# EAGLE design Esquematico ODJ-Raptor (EAGLE 7.6.0)
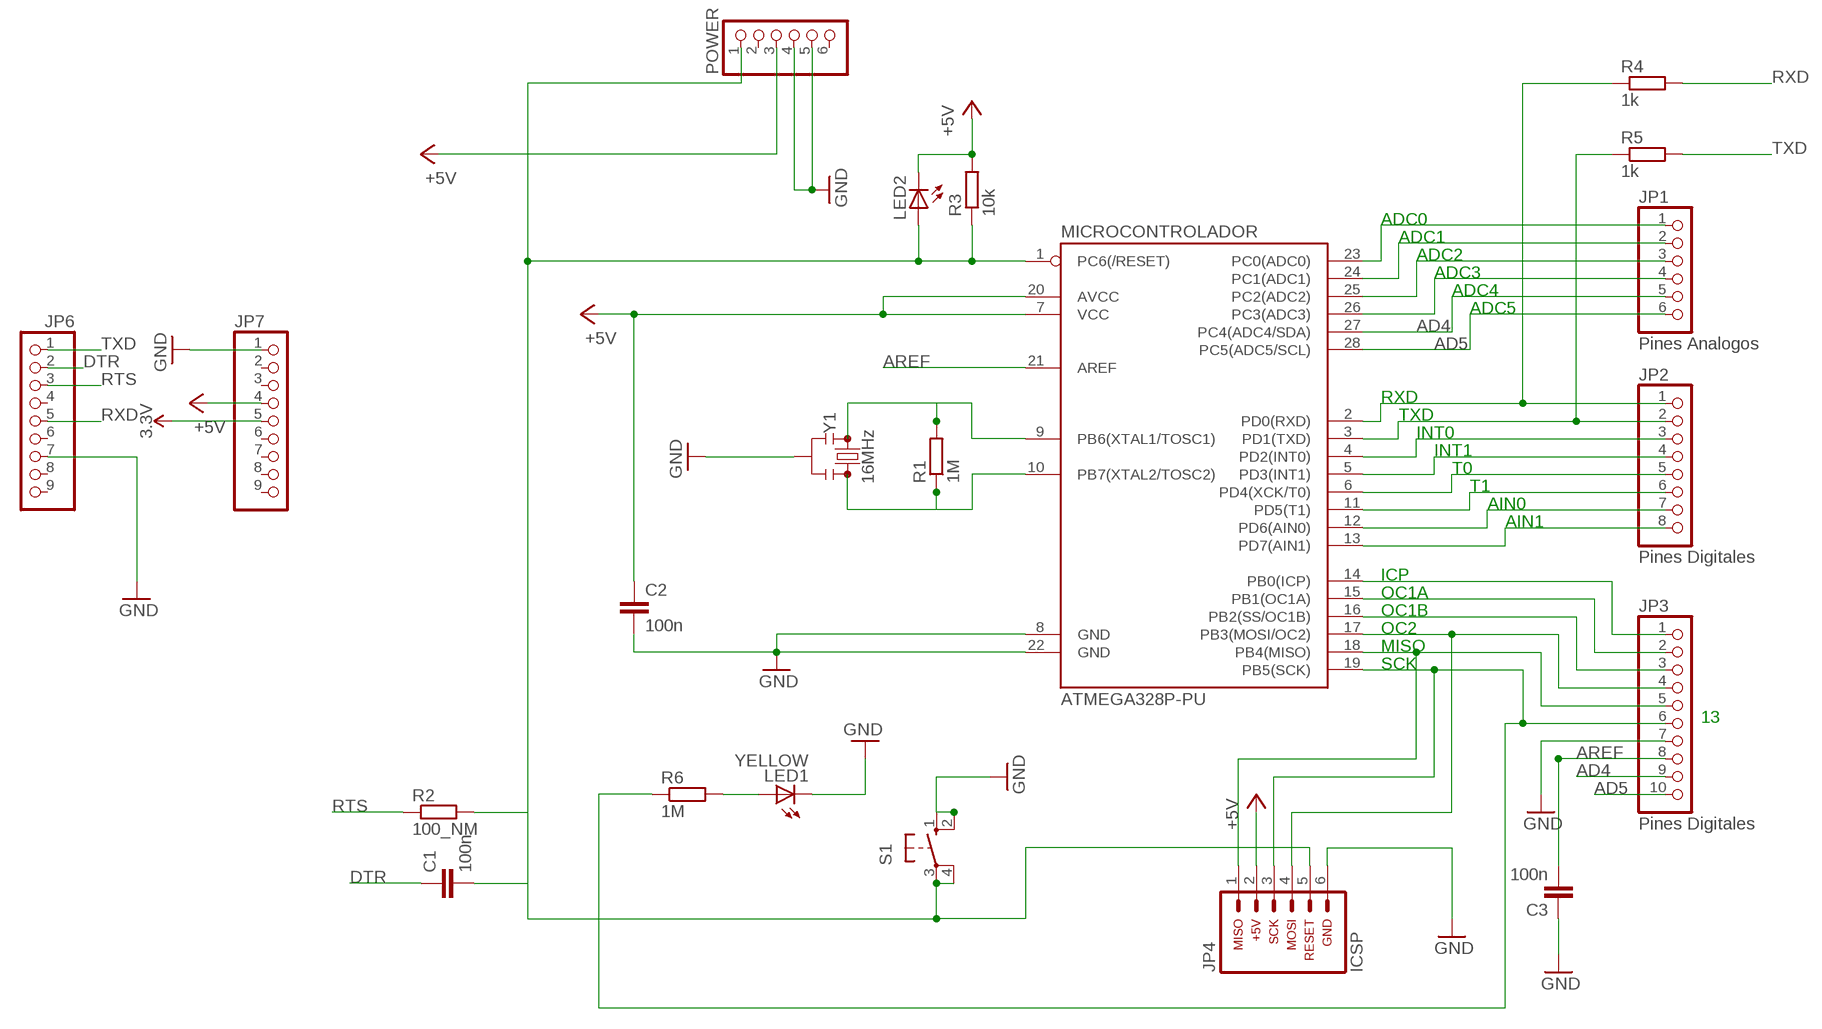
[diagram p0: schematic, sheet 1]

## Parts
C1  100n  C2.5/2  [C2.5-2]
C2  100n  C2.5/2  [C2.5-2]
C3  100n  C2.5/2  [C2.5-2]
JP1  Pines Analogos  PINHD-1X6  [1X06]
JP2  Pines Digitales  PINHD-1X8  [1X08]
JP3  Pines Digitales  PINHD-1X10  [1X10]
JP4  ARDUINO_CONN-ICSP  [CONN-2X03]
JP6  PINHD-1X9  [1X09-BIG]
JP7  PINHD-1X9  [1X09-BIG]
LED1  YELLOW  LED  [SMARTLED-TTW]
LED2  LED  [SMARTLED-TTW]
MICROCONTROLADOR  ATMEGA328P-PU  ATMEGA328P_PDIP  [DIP28]
POWER  PINHD-1X6  [1X06]
R1  1M  R-EU_0204/7  [0204/7]
R2  100_NM  R-EU_0204/7  [0204/7]
R3  10k  R-EU_0204/7  [0204/7]
R4  1k  R-EU_0204/7  [0204/7]
R5  1k  R-EU_0204/7  [0204/7]
R6  1M  R-EU_0204/7  [0204/7]
S1  10-XX  [B3F-10XX]
Y1  16MHz  RESONATOR-16MHZSMD_3.2X1.3  [RESONATOR-SMD-3.2X1.3]

## Nets
3.3V: JP7.5
+5V: C2.1 JP4.2 JP7.4 LED2.C@1(C) MICROCONTROLADOR.7(VCC) MICROCONTROLADOR.20(AVCC) POWER.3 R3.2
AD4: JP1.5 JP3.9 MICROCONTROLADOR.27(PC4(ADC4/SDA))
AD5: JP1.6 JP3.10 MICROCONTROLADOR.28(PC5(ADC5/SCL))
AREF: C3.2 JP3.8 MICROCONTROLADOR.21(AREF)
DTR: C1.1 JP6.2
GND: C2.2 C3.1 JP3.7 JP4.6 JP6.7 JP7.1 LED1.C@1(C) MICROCONTROLADOR.8(GND) MICROCONTROLADOR.22(GND) POWER.4 POWER.5 S1.1(S) S1.2(S1) Y1.2
N$1: JP1.1 MICROCONTROLADOR.23(PC0(ADC0))
N$2: JP1.2 MICROCONTROLADOR.24(PC1(ADC1))
N$3: JP1.3 MICROCONTROLADOR.25(PC2(ADC2))
N$4: JP1.4 MICROCONTROLADOR.26(PC3(ADC3))
N$7: JP2.1 MICROCONTROLADOR.2(PD0(RXD)) R4.1
N$8: JP2.2 MICROCONTROLADOR.3(PD1(TXD)) R5.1
N$9: JP2.3 MICROCONTROLADOR.4(PD2(INT0))
N$10: JP2.4 MICROCONTROLADOR.5(PD3(INT1))
N$11: JP2.5 MICROCONTROLADOR.6(PD4(XCK/T0))
N$12: JP2.6 MICROCONTROLADOR.11(PD5(T1))
N$13: JP2.7 MICROCONTROLADOR.12(PD6(AIN0))
N$14: JP2.8 MICROCONTROLADOR.13(PD7(AIN1))
N$15: JP3.1 MICROCONTROLADOR.14(PB0(ICP))
N$16: JP3.2 MICROCONTROLADOR.15(PB1(OC1A))
N$17: JP3.3 MICROCONTROLADOR.16(PB2(SS/OC1B))
N$18: JP3.4 JP4.4 MICROCONTROLADOR.17(PB3(MOSI/OC2))
N$19: JP3.5 JP4.1 MICROCONTROLADOR.18(PB4(MISO))
N$20: JP3.6 JP4.3 MICROCONTROLADOR.19(PB5(SCK)) R6.1
N$21: MICROCONTROLADOR.9(PB6(XTAL1/TOSC1)) R1.2 Y1.1
N$22: MICROCONTROLADOR.10(PB7(XTAL2/TOSC2)) R1.1 Y1.3
N$23: C1.2 JP4.5 LED2.A@1(A) MICROCONTROLADOR.1(PC6(/RESET)) POWER.1 R2.2 R3.1 S1.3(P) S1.4(P1)
N$30: LED1.A@1(A) R6.2
RTS: JP6.3 R2.1
RXD: JP6.5 R4.2
TXD: JP6.1 R5.2
Unconnected: JP6.4 JP6.6 JP6.8 JP6.9 JP7.2 JP7.3 JP7.6 JP7.7 JP7.8 JP7.9 POWER.2 POWER.6

## Notes on the sheet
- ADC0
- ADC1
- ADC2
- ADC3
- ADC4
- ADC5
- RXD
- TXD
- INT0
- INT1
- T0
- T1
- AIN0
- AIN1
- ICP
- OC1A
- OC1B
- OC2
- MISO
- SCK
- 13

## Library data of the parts
C1-C3 = capacitor-wima:C: CAPACITOR naming: grid - package width
JP1 = pinhead:PINHD-1X6: PIN HEADER
JP2 = pinhead:PINHD-1X8: PIN HEADER
JP3 = pinhead:PINHD-1X10: PIN HEADER
JP4 = arduino_jw:ARDUINO_CONN-ICSP: Arduino ICSP I/O Header This is the ICSP I/O header on the Arduino Uno R3. This connector is labeled with the following pin assignments: MISO +5V SCK MOSI RESET GND NOTE: Be sure you install this connector with the correct orientation on your PCB layout. Pin 1 has a square pad to assist with orientation.
JP6 JP7 = adafruit:PINHD-1X9: Pin header 1x10 0.1" spacing With round pins
LED1 = adafruit:LED: LED
LED2 = led:LED: LED
MICROCONTROLADOR = SparkFun-IC-Microcontroller:ATMEGA328P_PDIP: Atmel 328P Through hole ATMEGA328P uC used in the Arduino 32kb flash, 1k EEPROM, 2k SRAM Datasheet <http://www.sparkfun.com/datasheets/Components/SMD/ATMega328.pdf> SparkFun Products Storefront component: AVR 28 Pin 20MHz 32K 6A/D - ATMega328P <https://www.sparkfun.com/products/9061> (COM-09061) SparkFun Simon Says - Through-Hole Soldering Kit <https://www.sparkfun.com/products/10547> (KIT-10547) SparkFun Learn to Solder - Simon Says <https://www.sparkfun.com/products/13708> (KIT-13708) SparkFun BigTime Watch Kit <https://www.sparkfun.com/products/11734> (KIT-11734) SparkFun ClockIt <https://www.sparkfun.com/products/10930> (KIT-10930) SparkFun Serial Enabled LCD Kit <https://www.sparkfun.com/products/10097> (LCD-10097) SparkFun Simon Tilts - Through Hole Soldering Kit <https://www.sparkfun.com/products/12634> (KIT-12634) SparkFun Frequency Counter Kit <https://www.sparkfun.com/products/10140> (KIT-10140) FabFM Radio Kit <https://www.sparkfun.com/products/11043> (KIT-11043) SparkFun Binary Blaster Kit <https://www.sparkfun.com/products/12037> (KIT-12037) SparkFun Metro-Gnome <https://www.sparkfun.com/products/9236> (KIT-09236) ATmega328 with Arduino Optiboot (Uno) <https://www.sparkfun.com/products/10524> (DEV-10524); PROD_ID: IC-09136; VALUE: 328P
POWER = adafruit:PINHD-1X6: PIN HEADER
R1-R6 = resistor:R-EU_: RESISTOR, European symbol
S1 = switch-omron:10-XX: OMRON SWITCH; MPN: B3F-1000; OC_FARNELL: 176432; OC_NEWARK: 36M3542
Y1 = SparkFun-Clocks:RESONATOR-16MHZ: 16MHz Resonator Digikey Example <http://www.digikey.com/product-detail/en/murata-electronics-north-america/CSTCE16M0V53-R0/490-1198-1-ND/584635> Frequency: 16MHz Frequency Stability: ±0.3% Frequency Tolerance: ±0.5% Capacitance: 15pF SparkFun Products SparkFun OpenLog <https://www.sparkfun.com/products/13712> SparkFun MicroView - OLED Arduino Module <https://www.sparkfun.com/products/12923>; PROD_ID: XTAL-08900

## Board
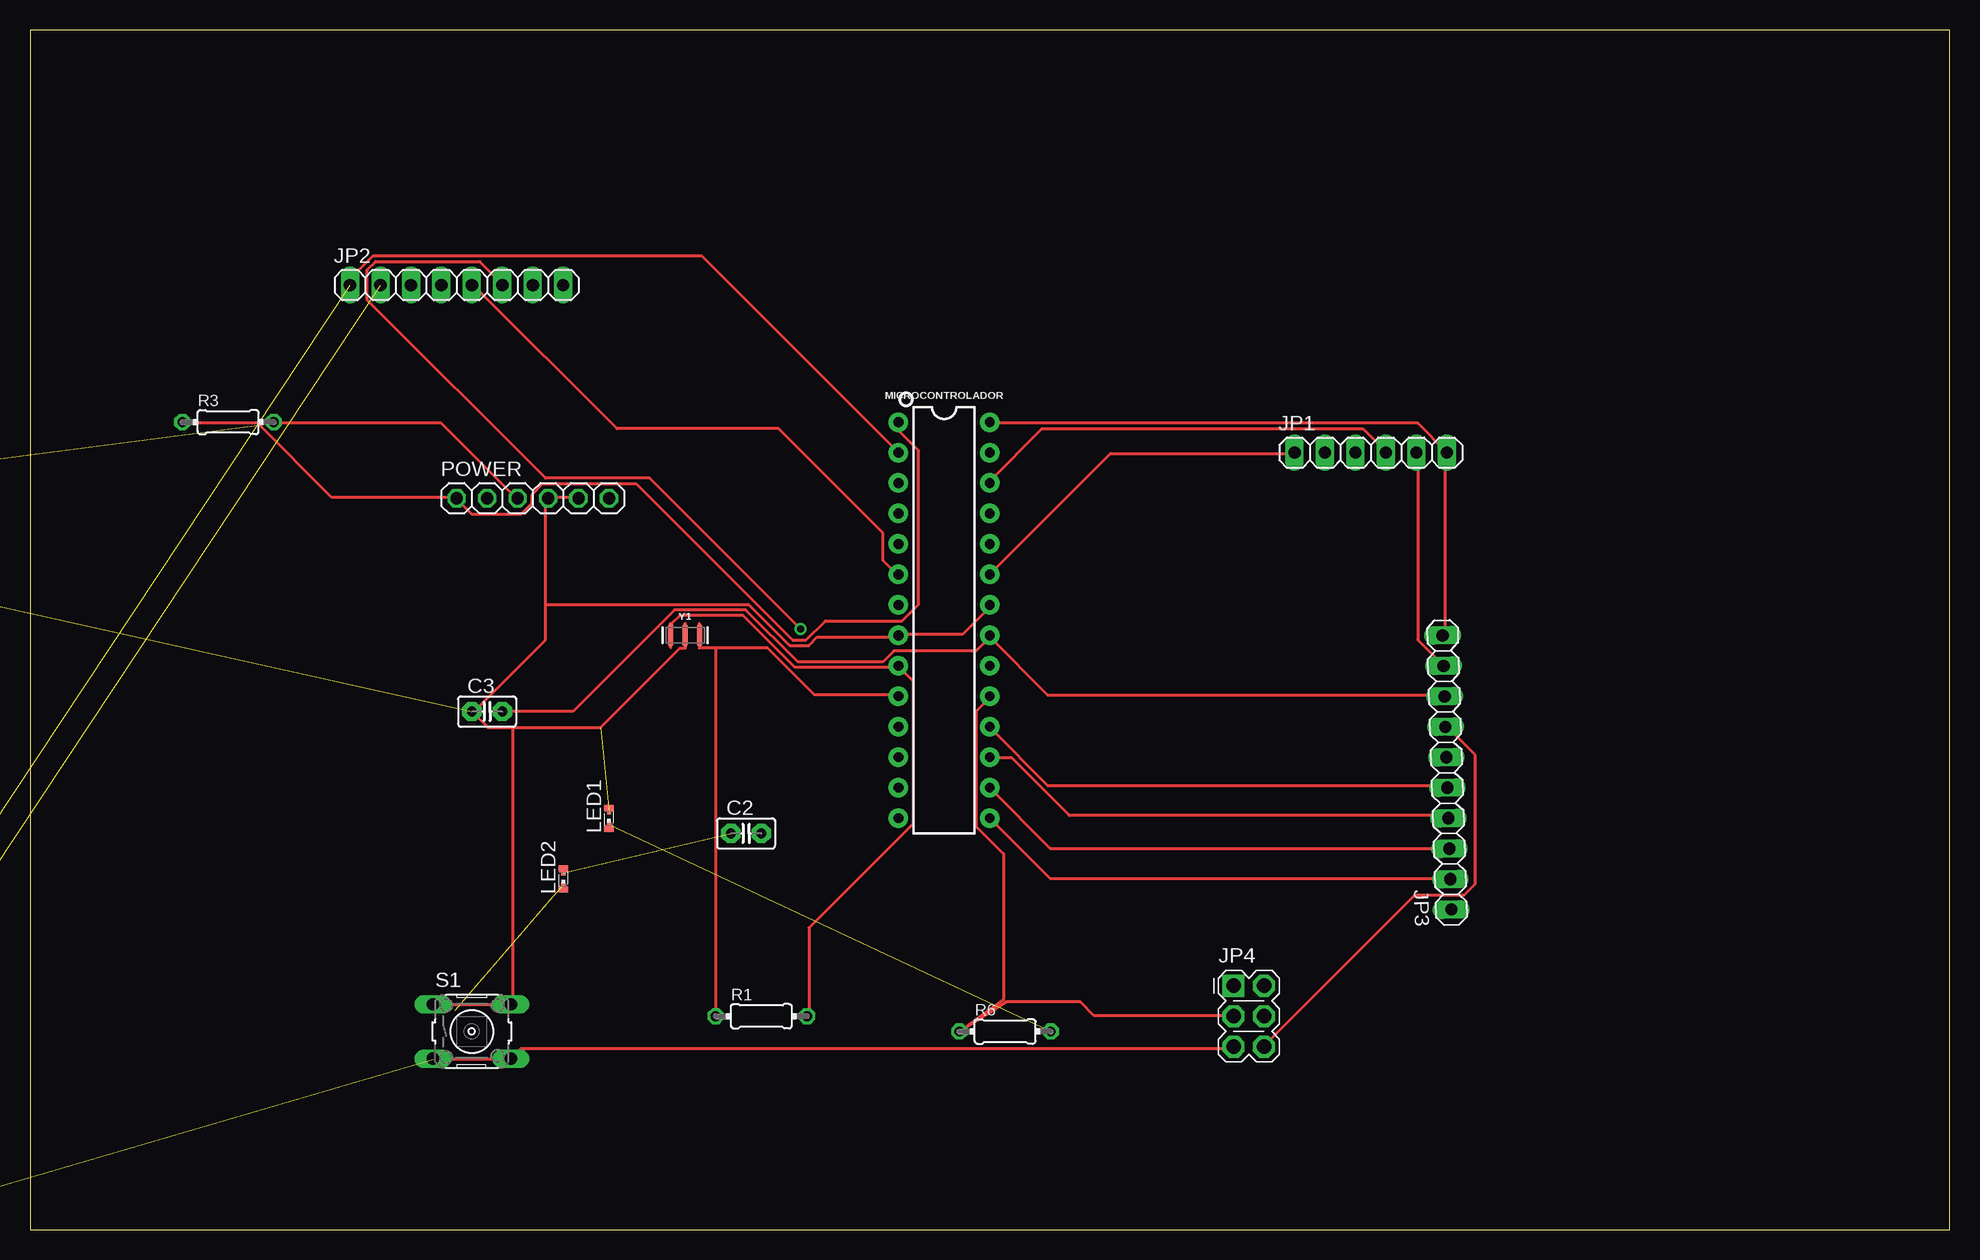
[diagram p1: board, top side]
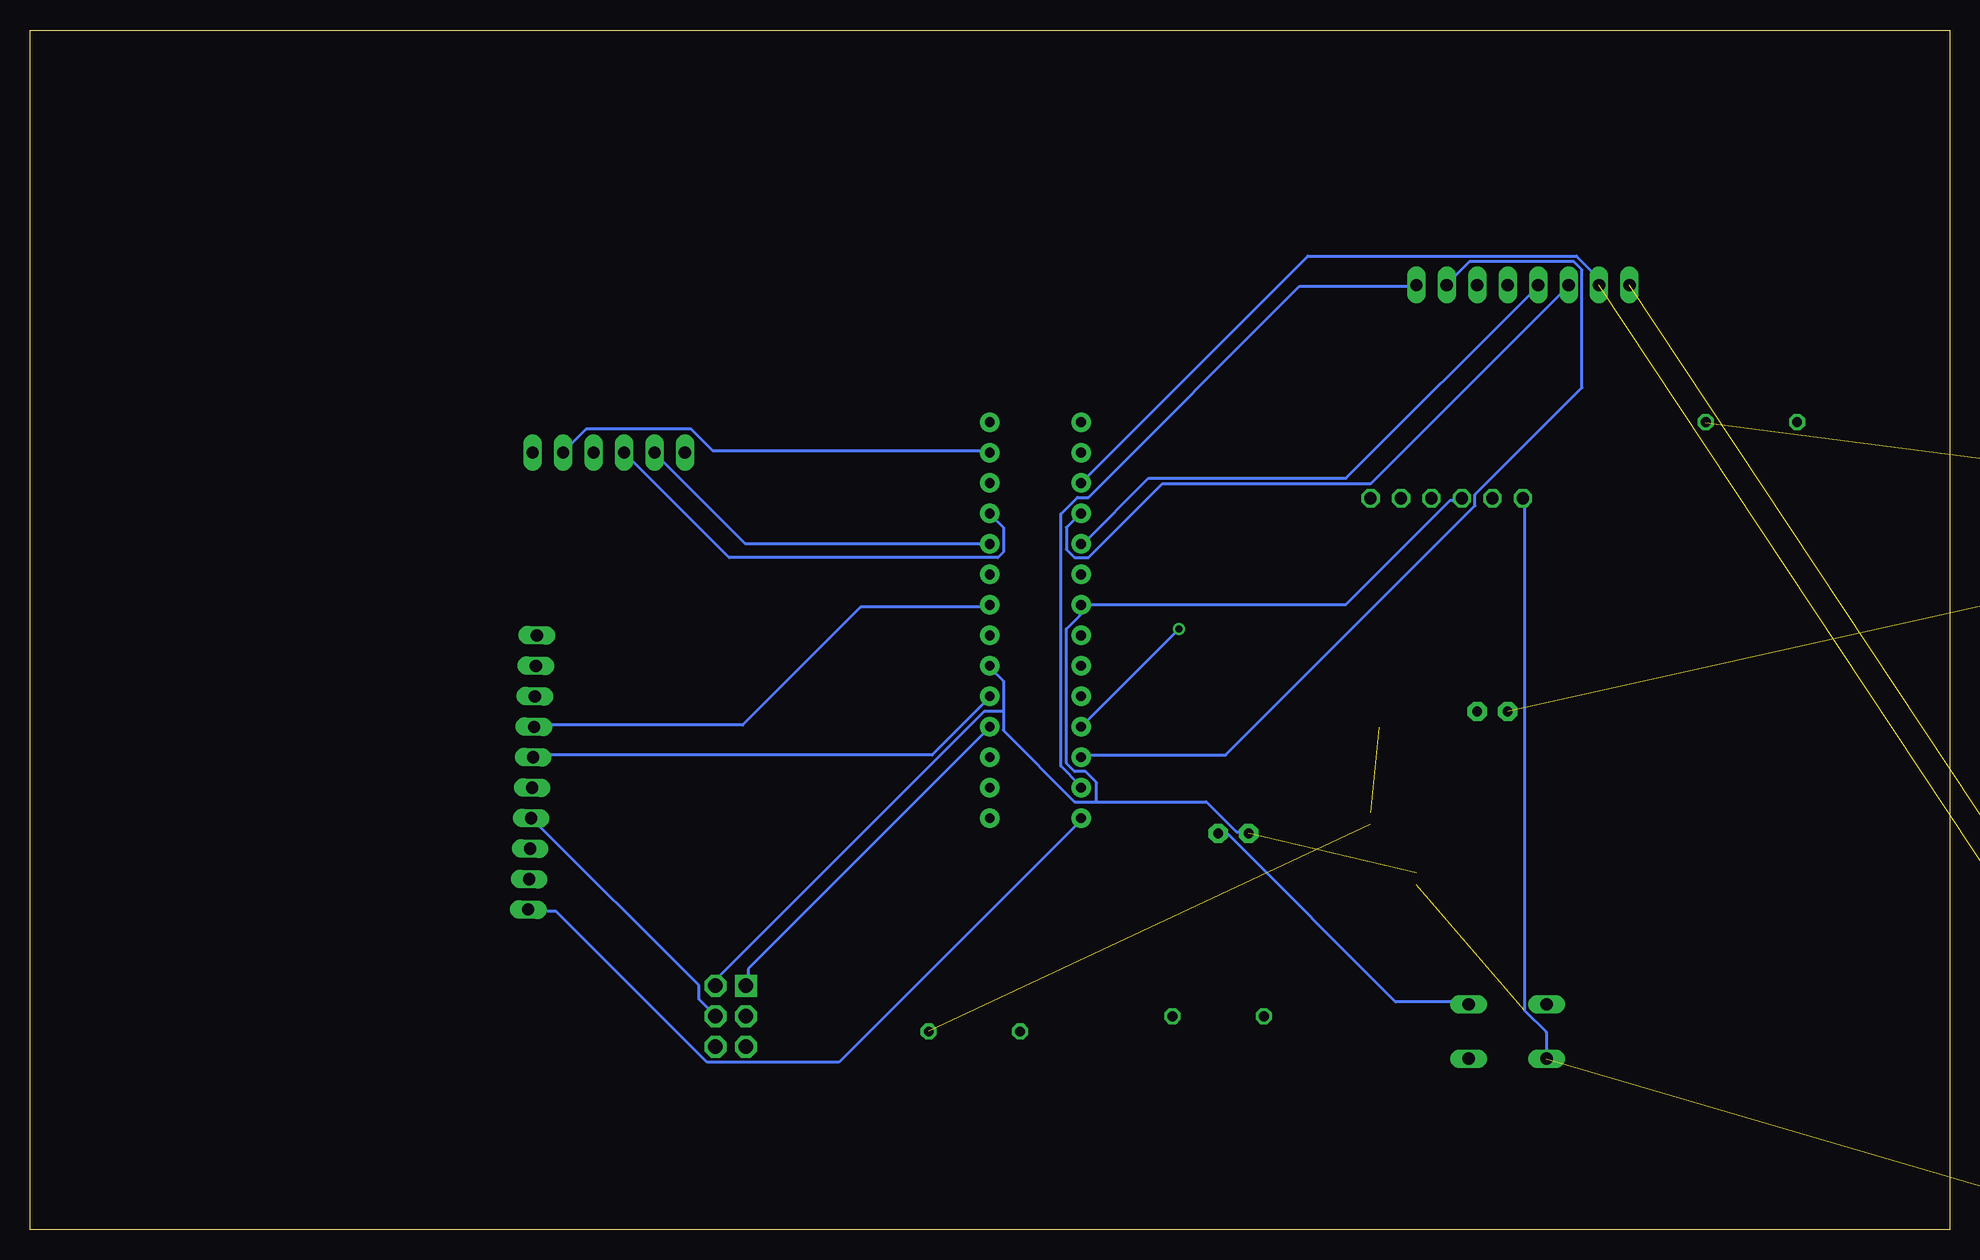
[diagram p2: board, bottom side, seen from below]

Size 160 x 100 mm. Coordinates in mm from the lower left corner, seen from the top.
Outline: 0,0 160,0 160,100 0,100 0,0
Copper layers (1*16): Top 0.035mm / dielectric 1.5mm / Bottom 0.035mm
Design rules "default": minimum track width 10mil, minimum drill 24mil, track to track 8mil, track to pad 8mil, pad to pad 8mil, via to via 8mil, smd to smd 8mil, copper to edge 40mil, drill to drill 8mil, minimum pad ring 10mil, minimum via ring 8mil, stop-mask expansion 4mil, vias tented up to drill 0mil, thermal gap 10mil

### Footprints (pad centres in the part's own frame; a part is rotated, then mirrored left to right if it is on the bottom)
C2.5-2 = drill 0.813 pad 1.6 octagon: 1 -1.27,0; 2 1.27,0
1X06 = drill 1.016 long: 1 -6.35,0; 2 -3.81,0; 3 -1.27,0; 4 1.27,0; 5 3.81,0; 6 6.35,0
1X08 = drill 1.016 long: 1 -8.89,0; 2 -6.35,0; 3 -3.81,0; 4 -1.27,0; 5 1.27,0; 6 3.81,0; 7 6.35,0; 8 8.89,0
1X10 = drill 1.016 long: 1 -11.43,0; 2 -8.89,0; 3 -6.35,0; 4 -3.81,0; 5 -1.27,0; 6 1.27,0; 7 3.81,0; 8 6.35,0; 9 8.89,0; 10 11.43,0
CONN-2X03 = drill 1.2 pad 1.829 square: 1 0,0 | drill 1.2 pad 1.829 octagon: 2 2.54,0; 3 0,-2.54; 4 2.54,-2.54; 5 0,-5.08; 6 2.54,-5.08
1X09-BIG = drill 1.016 pad 1.778 octagon: 1 -10.16,0; 2 -7.62,0; 3 -5.08,0; 4 -2.54,0; 5 0,0; 6 2.54,0; 7 5.08,0; 8 7.62,0; 9 10.16,0
SMARTLED-TTW = smd 0.8 x 0.5: A 0,-0.875; C 0,0.875 | smd 0.35 x 0.35: A@1 0,-0.5; C@1 0,0.5
DIP28 = drill 0.813 pad 1.626: 1 -16.51,-3.81; 2 -13.97,-3.81; 3 -11.43,-3.81; 4 -8.89,-3.81; 5 -6.35,-3.81; 6 -3.81,-3.81; 7 -1.27,-3.81; 8 1.27,-3.81; 9 3.81,-3.81; 10 6.35,-3.81; 11 8.89,-3.81; 12 11.43,-3.81; 13 13.97,-3.81; 14 16.51,-3.81; 15 16.51,3.81; 16 13.97,3.81; 17 11.43,3.81; 18 8.89,3.81; 19 6.35,3.81; 20 3.81,3.81; 21 1.27,3.81; 22 -1.27,3.81; 23 -3.81,3.81; 24 -6.35,3.81; 25 -8.89,3.81; 26 -11.43,3.81; 27 -13.97,3.81; 28 -16.51,3.81
1X06' = drill 1.016 octagon: 1 -6.35,0; 2 -3.81,0; 3 -1.27,0; 4 1.27,0; 5 3.81,0; 6 6.35,0
0204/7 = drill 0.813 octagon: 1 -3.81,0; 2 3.81,0
B3F-10XX = drill 1.016 long: 1 -3.251,2.261; 2 3.251,2.261; 3 -3.251,-2.261; 4 3.251,-2.261
RESONATOR-SMD-3.2X1.3 = smd 0.45 x 1.905: 1 -1.2,0; 2 0,0; 3 1.2,0

### Placement (x,y rotation side)
C1  -34.29,-8.89 0 top  (outside the outline)
C2  59.69,33.02 0 top
C3  38.1,43.18 0 top
JP1  111.76,64.77 0 top
JP2  35.56,78.74 0 top
JP3  118.11,38.1 91.8 top
JP4  100.33,20.32 0 top
JP6  -25.4,55.88 0 top  (outside the outline)
JP7  -25.4,60.96 0 top  (outside the outline)
LED1  48.26,34.29 0 top
LED2  44.45,29.21 0 top
MICROCONTROLADOR  76.2,50.8 270 top
POWER  [1X06']  41.91,60.96 0 top
R1  60.96,17.78 0 top
R2  -31.75,-3.81 0 top  (outside the outline)
R3  16.51,67.31 0 top
R4  -31.75,-15.24 0 top  (outside the outline)
R5  -31.75,-19.05 0 top  (outside the outline)
R6  81.28,16.51 0 top
S1  36.83,16.51 0 top
Y1  54.61,49.53 0 top

### Tracks (layer width: path | path; a pad name or v marks a point on that pad's centre or on a via)
+5V  (2 unrouted)
  Top 0.254: R3.2 20.34,67.21 34.29,67.21 40.46,61.04 POWER.3
  Bottom 0.254: 71.09,35.66 72.92,35.66 78.87,41.6 78.87,43.2 | 71.09,35.66 61.95,35.66 59.44,33.15 58.52,33.15 C2.1 | 78.87,43.2 78.87,45.72 80.01,46.86 MICROCONTROLADOR.20 | 71.09,35.66 71.09,37.26 72.01,38.18 72.92,38.18 73.61,38.86 73.61,50.06 72.47,51.21 72.47,51.89 MICROCONTROLADOR.7 72.24,52.12 50.29,52.12 41.6,60.81 40.69,60.81 POWER.3 | JP4.2 102.87,20.8 80.47,43.2 78.87,43.2
AD4
  Top 0.254: JP3.9 117.73,47.09 115.67,49.15 115.67,64.69 JP1.5
  Bottom 0.254: MICROCONTROLADOR.27 80.01,64.92 103.1,64.92 104.93,66.75 113.61,66.75 115.44,64.92 JP1.5
AD5
  Top 0.254: JP3.10 117.96,49.61 117.96,64.69 JP1.6 115.67,67.21 80.01,67.21 MICROCONTROLADOR.28
AREF
  Top 0.254: 80.01,49.38 84.81,44.58 117.73,44.58 JP3.8 | 80.01,49.38 78.87,48.23 72.01,48.23 71.09,47.32 64.01,47.32 59.66,51.66 53.72,51.66 45.26,43.2 39.55,43.2 C3.2 | 80.01,49.38 MICROCONTROLADOR.21
DTR  (1 unrouted)
GND  (3 unrouted)
  Top 0.254: JP3.7 118.19,41.83 120.47,39.55 120.47,28.8 119.56,27.89 115.44,27.89 102.87,15.32 JP4.6 | S1.1 33.6,18.75 40.01,18.75 S1.2 40.23,18.97 40.23,41.83 | MICROCONTROLADOR.22 80.01,51.89 77.72,49.61 72.47,49.61 MICROCONTROLADOR.8 72.24,49.38 65.61,49.38 64.92,48.69 63.32,48.69 59.89,52.12 42.98,52.12 | POWER.5 45.72,61.04 43.2,61.04 POWER.4 42.98,60.81 42.98,52.12 | 40.23,41.83 38.18,41.83 C3.1 37.03,43.2 42.98,49.15 42.98,52.12 | 40.23,41.83 47.55,41.83 54.18,48.46 54.63,48.46 54.61,48.51
  Bottom 0.254: C2.2 60.81,32.92 60.12,32.92 46.18,18.97 40.23,18.97 S1.2 | JP3.7 117.96,42.06 100.58,42.06 90.75,51.89 80.01,51.89 MICROCONTROLADOR.22
N$1
  Top 0.254: JP1.1 105.39,64.69 90.07,64.69 80.01,54.63 MICROCONTROLADOR.23
N$2
  Bottom 0.254: MICROCONTROLADOR.24 100.36,57.15 107.9,64.69 JP1.2
N$3
  Bottom 0.254: JP1.3 101.73,56.01 79.32,56.01 78.87,56.46 78.87,58.52 80.01,59.66 MICROCONTROLADOR.25
N$4
  Top 0.254: JP1.4 112.93,64.92 111.1,66.75 84.35,66.75 80.01,62.41 MICROCONTROLADOR.26
N$7  (1 unrouted)
  Top 0.254: MICROCONTROLADOR.2 56.01,81.15 28.57,81.15 26.75,79.32 26.75,78.87 JP2.1
N$8  (1 unrouted)
  Bottom 0.254: JP2.2 29.26,78.87 29.26,79.32 31.09,81.15 53.49,81.15 72.24,62.41 MICROCONTROLADOR.3
N$9
  Bottom 0.254: JP2.3 31.77,78.64 48.23,62.18 65.61,62.18 71.78,56.01 72.92,56.01 73.61,56.69 73.61,58.52 72.47,59.66 MICROCONTROLADOR.4
N$10
  Bottom 0.254: JP2.4 34.29,78.64 50.29,62.64 66.75,62.64 72.24,57.15 MICROCONTROLADOR.5
N$11
  Top 0.254: JP2.5 37.03,78.64 48.92,66.75 62.41,66.75 71.09,58.06 71.09,55.78 72.24,54.63 MICROCONTROLADOR.6
N$12  (via drill 0.61)
  Top 0.254: v64.24,50.06 51.66,62.64 42.98,62.64 28.12,77.5 28.12,80.01 28.8,80.7 37.49,80.7 39.32,78.87 JP2.6
  Bottom 0.254: MICROCONTROLADOR.11 v64.24,50.06
N$13
  Bottom 0.254: JP2.7 41.83,78.87 40.01,80.7 31.32,80.7 30.63,80.01 30.63,70.18 39.55,61.27 39.55,60.35 60.35,39.55 72.24,39.55 MICROCONTROLADOR.12
N$14
  Bottom 0.254: JP2.8 44.58,78.64 54.18,78.64 71.78,61.04 72.69,61.04 74.07,59.66 74.07,38.63 72.47,37.03 MICROCONTROLADOR.13
N$15
  Bottom 0.254: JP3.1 118.42,26.52 116.13,26.52 103.56,13.95 92.58,13.95 72.24,34.29 MICROCONTROLADOR.14
N$16
  Top 0.254: MICROCONTROLADOR.15 85.04,29.26 118.19,29.26 JP3.2
N$17
  Top 0.254: JP3.3 118.19,31.77 85.04,31.77 80.01,36.8 MICROCONTROLADOR.16
N$18
  Top 0.254: MICROCONTROLADOR.17 80.01,39.32 81.84,39.32 86.64,34.52 118.19,34.52 JP3.4
  Bottom 0.254: JP3.4 118.19,34.29 104.24,20.34 104.24,19.2 102.87,17.83 JP4.4
N$19
  Top 0.254: JP3.5 117.96,37.03 84.81,37.03 80.01,41.83 MICROCONTROLADOR.18
  Bottom 0.254: JP4.1 100.13,20.34 100.13,21.72 80.01,41.83 MICROCONTROLADOR.18
N$20
  Top 0.254: JP4.3 100.13,17.83 88.7,17.83 87.55,18.97 81.38,18.97 R6.1 81.15,19.2 81.15,31.32 78.87,33.6 78.87,43.2 80.01,44.35 MICROCONTROLADOR.19
  Bottom 0.254: JP3.6 117.96,39.55 84.81,39.55 80.01,44.35 MICROCONTROLADOR.19
N$21
  Top 0.254: Y1.1 53.49,50.52 54.18,51.21 59.44,51.21 63.78,46.86 72.24,46.86 MICROCONTROLADOR.9 72.47,46.86 73.61,45.72 73.61,33.83 64.92,25.15 64.92,17.83 R1.2
N$22
  Top 0.254: 57.15,48.46 61.49,48.46 65.38,44.58 72.24,44.58 MICROCONTROLADOR.10 | 57.15,48.46 55.78,48.46 55.81,48.51 | 57.15,48.46 R1.1
N$23  (3 unrouted)
  Top 0.254: S1.3 33.6,14.17 40.01,14.17 S1.4 40.92,15.09 100.13,15.09 JP4.5 | R3.1 12.8,67.21 18.97,67.21 25.15,61.04 35.43,61.04 POWER.1 35.66,60.81 36.8,59.66 40.92,59.66 41.83,60.58 41.83,61.27 42.75,62.18 50.52,62.18 63.55,49.15 64.69,49.15 66.29,50.75 72.69,50.75 74.07,52.12 74.07,64.92 72.47,66.52 72.47,67.21 MICROCONTROLADOR.1
  Bottom 0.254: S1.3 33.6,14.4 33.6,16.46 35.43,18.29 35.43,60.81 POWER.1
N$30  (1 unrouted)
RTS  (1 unrouted)
RXD  (1 unrouted)
TXD  (1 unrouted)